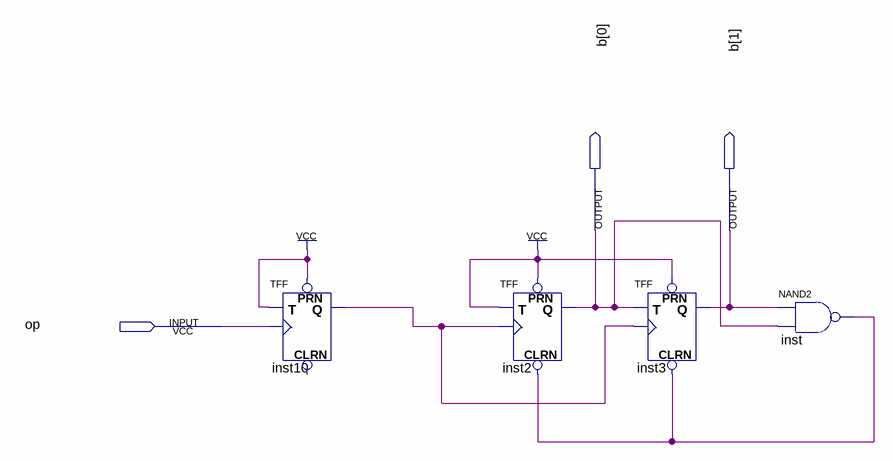
[diagram p0: schematic sheet]
// Quartus schematic counter_2bits.bdf as structural Verilog: 4 symbols, 3 pins
module counter_2bits (
  input  op,
  output [1:0] b
);

  wire inst10_q, inst_out;

  TFF inst10 (.PRN(1'b1), .T(1'b1), .CLK(op), .Q(inst10_q));  // open: CLRN
  TFF inst2 (.PRN(1'b1), .CLRN(inst_out), .T(1'b1), .CLK(inst10_q), .Q(b[0]));
  TFF inst3 (.PRN(1'b1), .CLRN(inst_out), .T(b[0]), .CLK(inst10_q), .Q(b[1]));
  nand inst (inst_out, b[1], b[0]);
endmodule
